# Altium schematic sheet CameraBoard.SchDoc
size A0
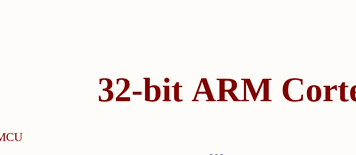
[diagram p0: CameraBoard.SchDoc, top left]
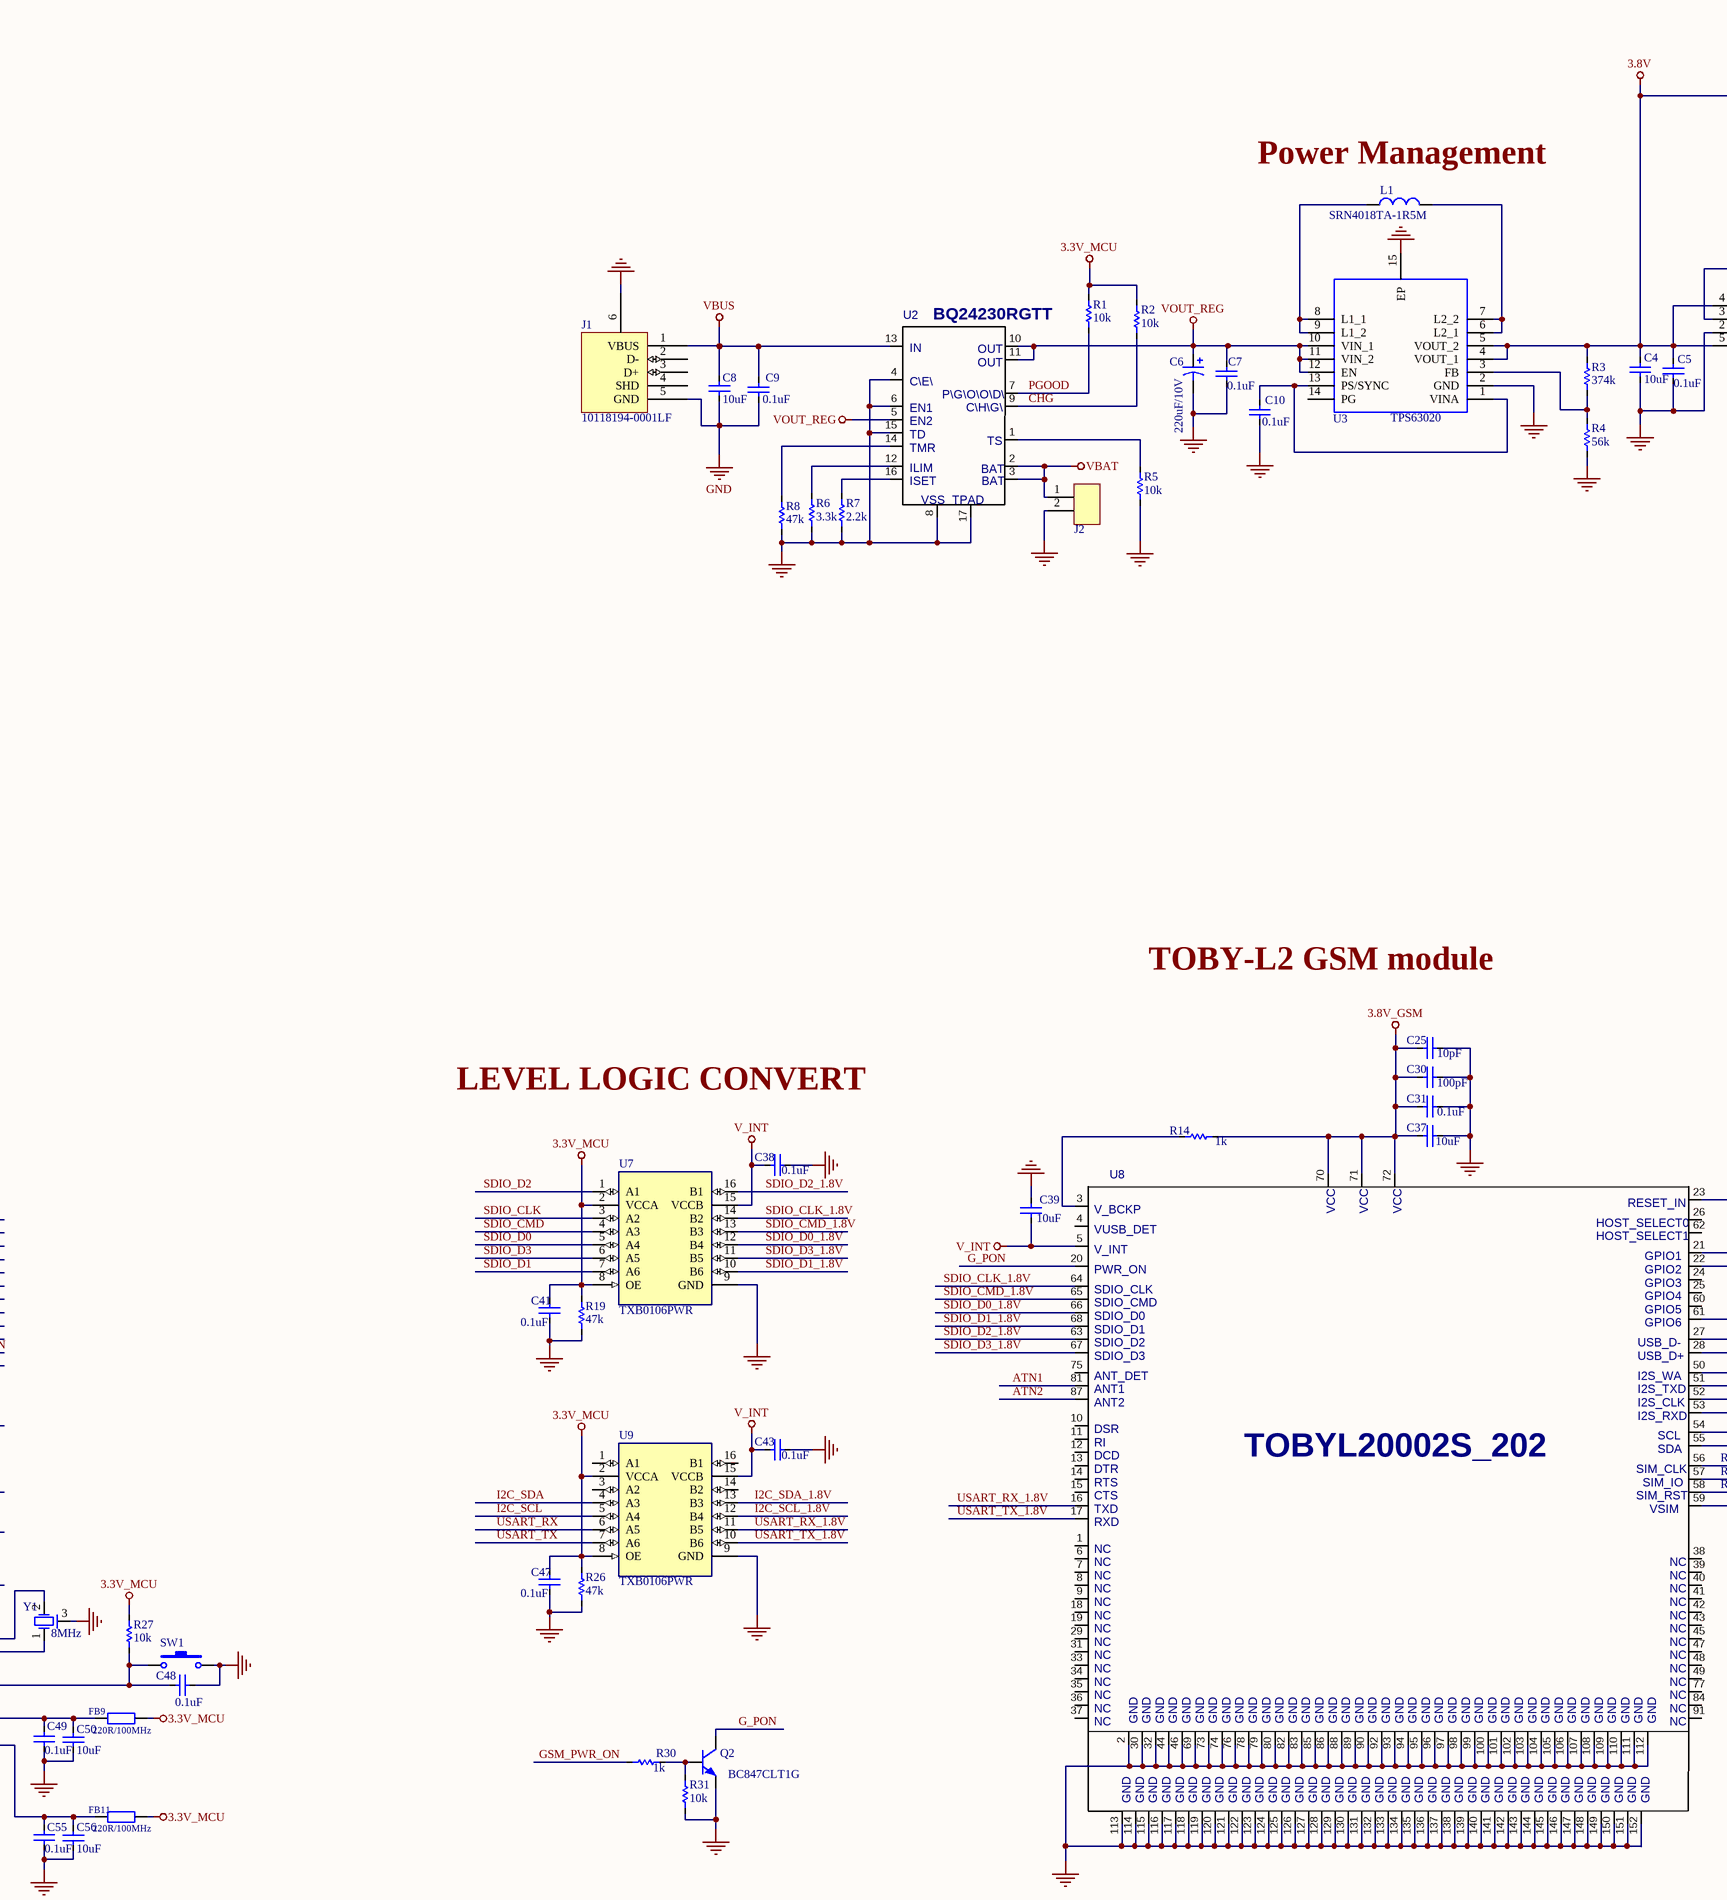
[diagram p1: CameraBoard.SchDoc, top middle]
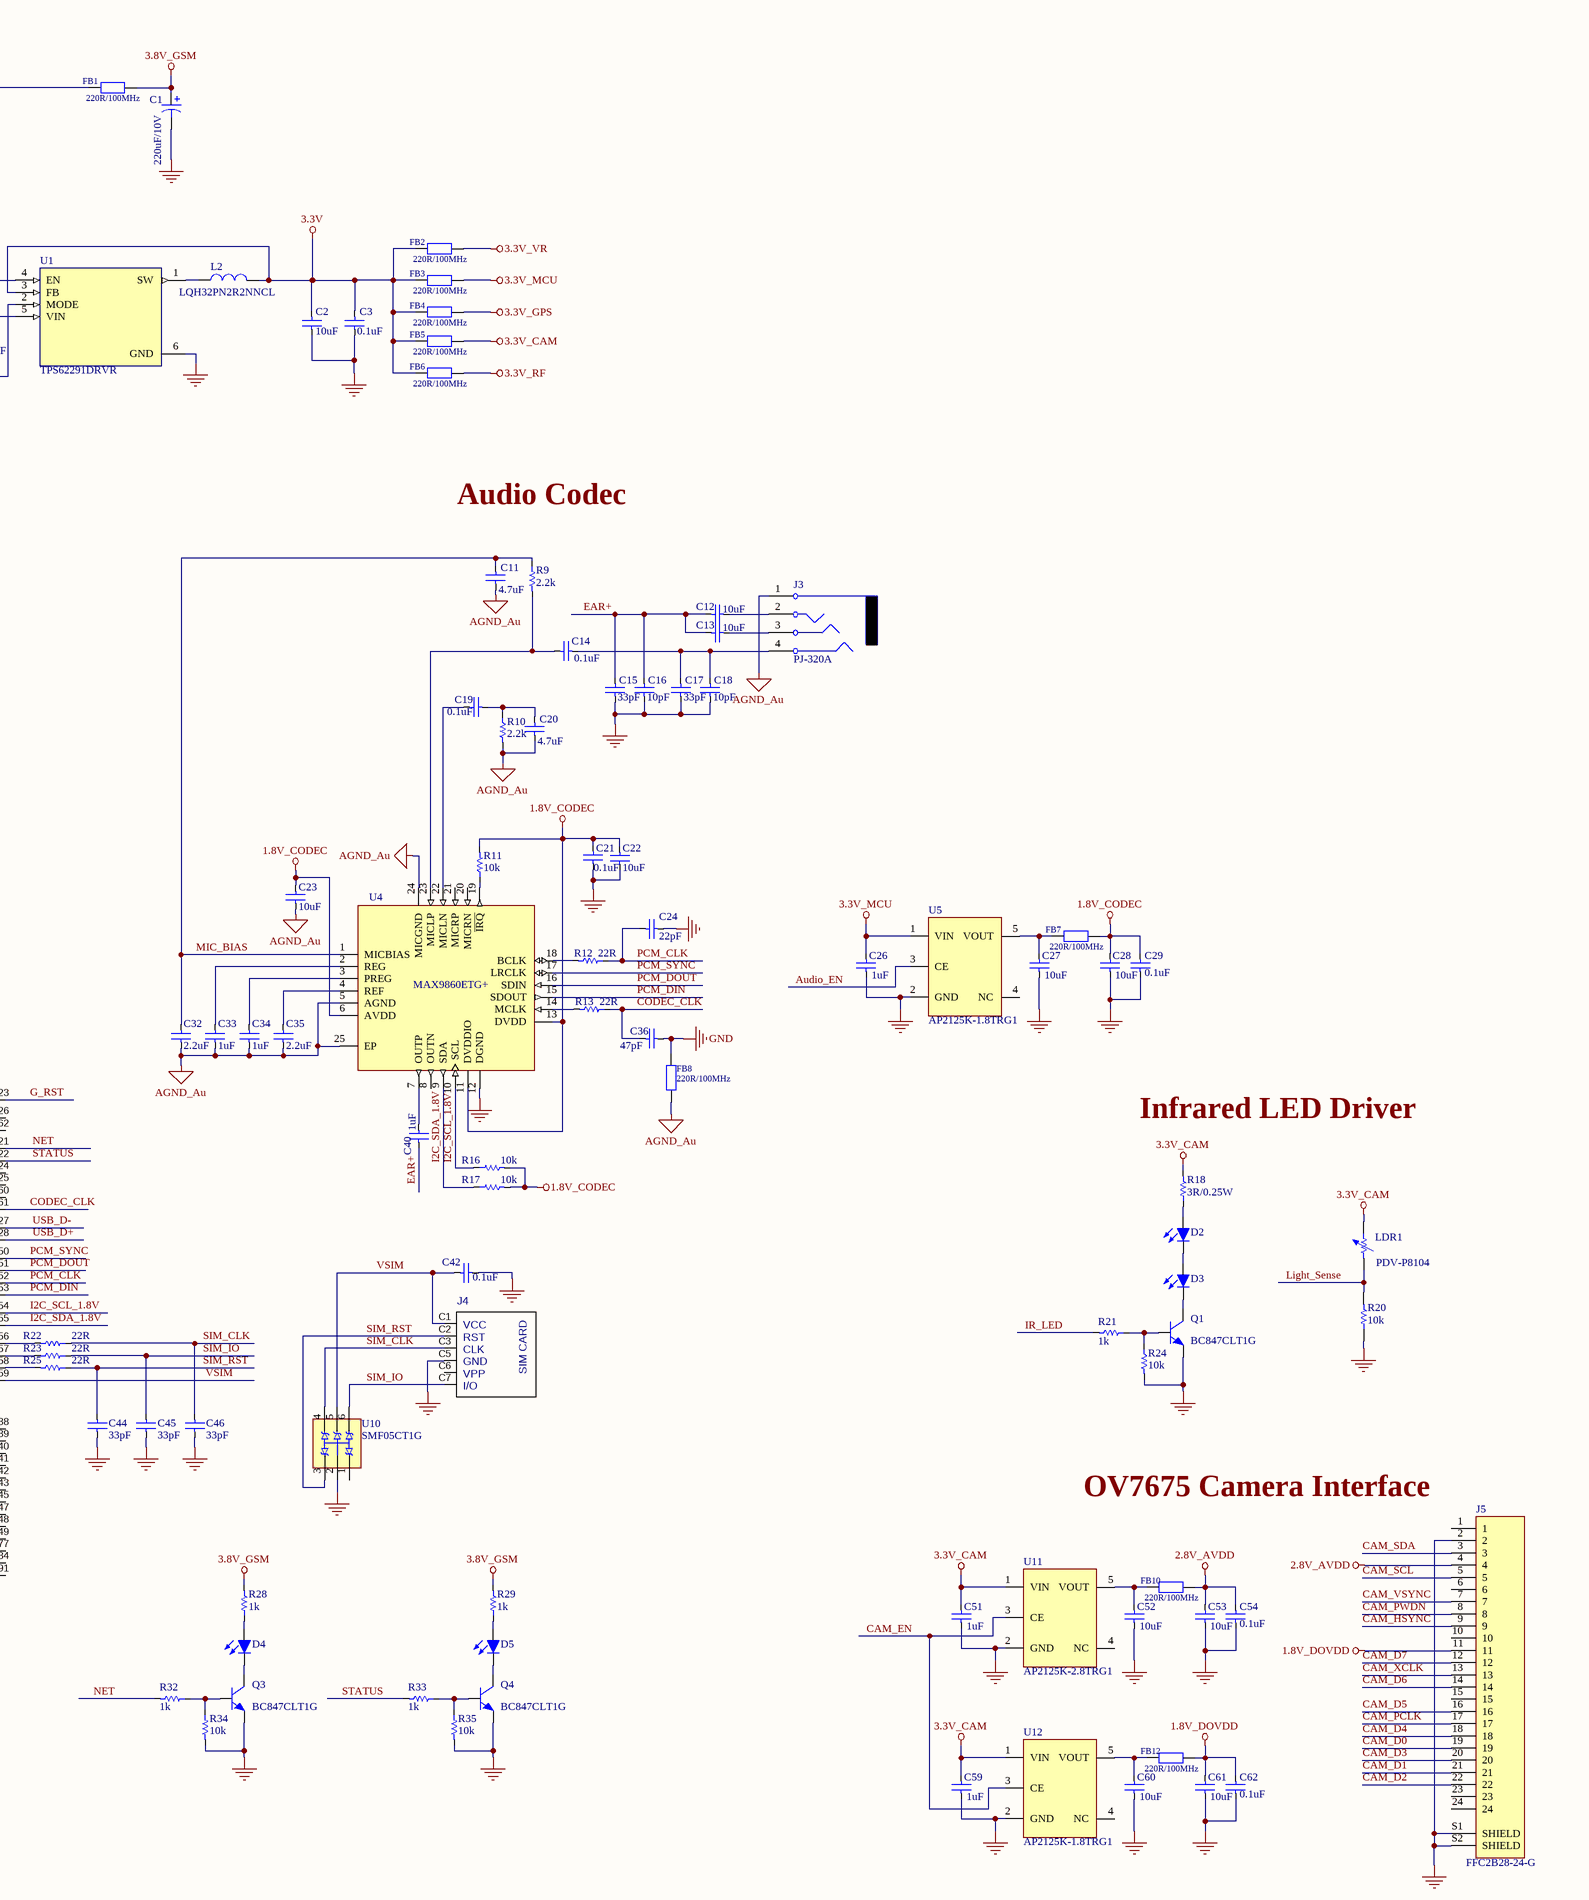
[diagram p2: CameraBoard.SchDoc, top right]
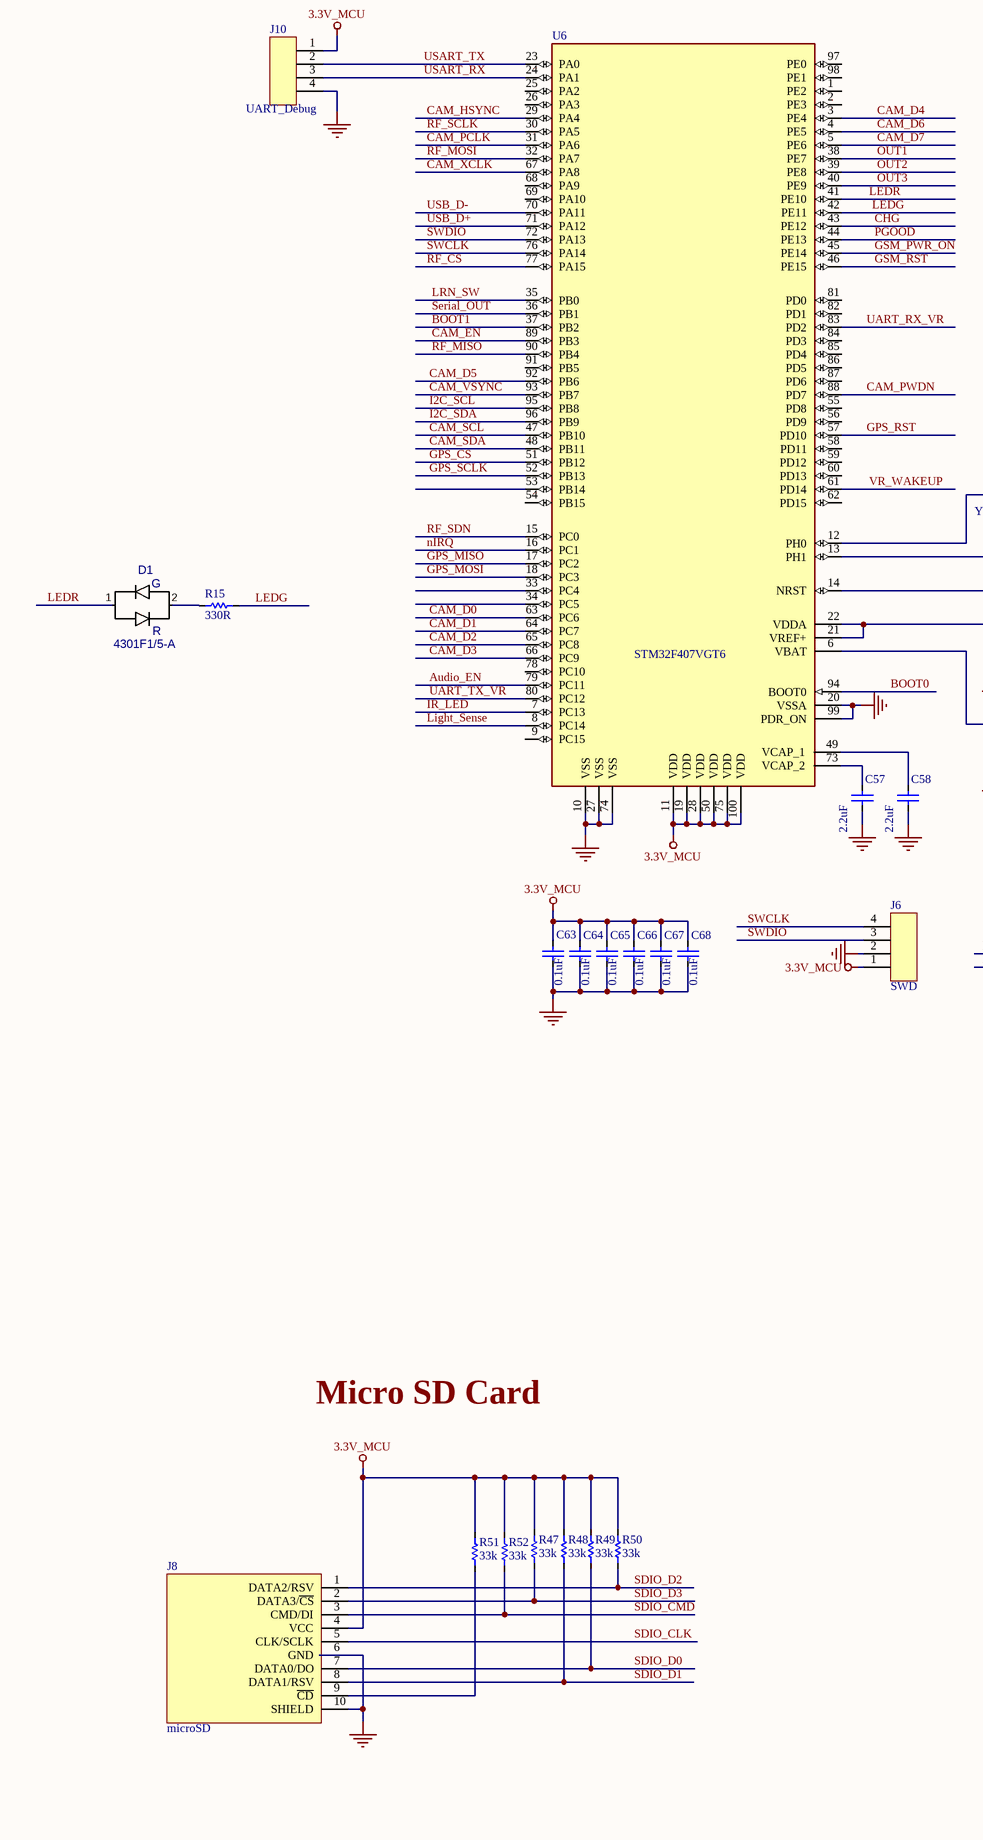
[diagram p3: CameraBoard.SchDoc, bottom left]
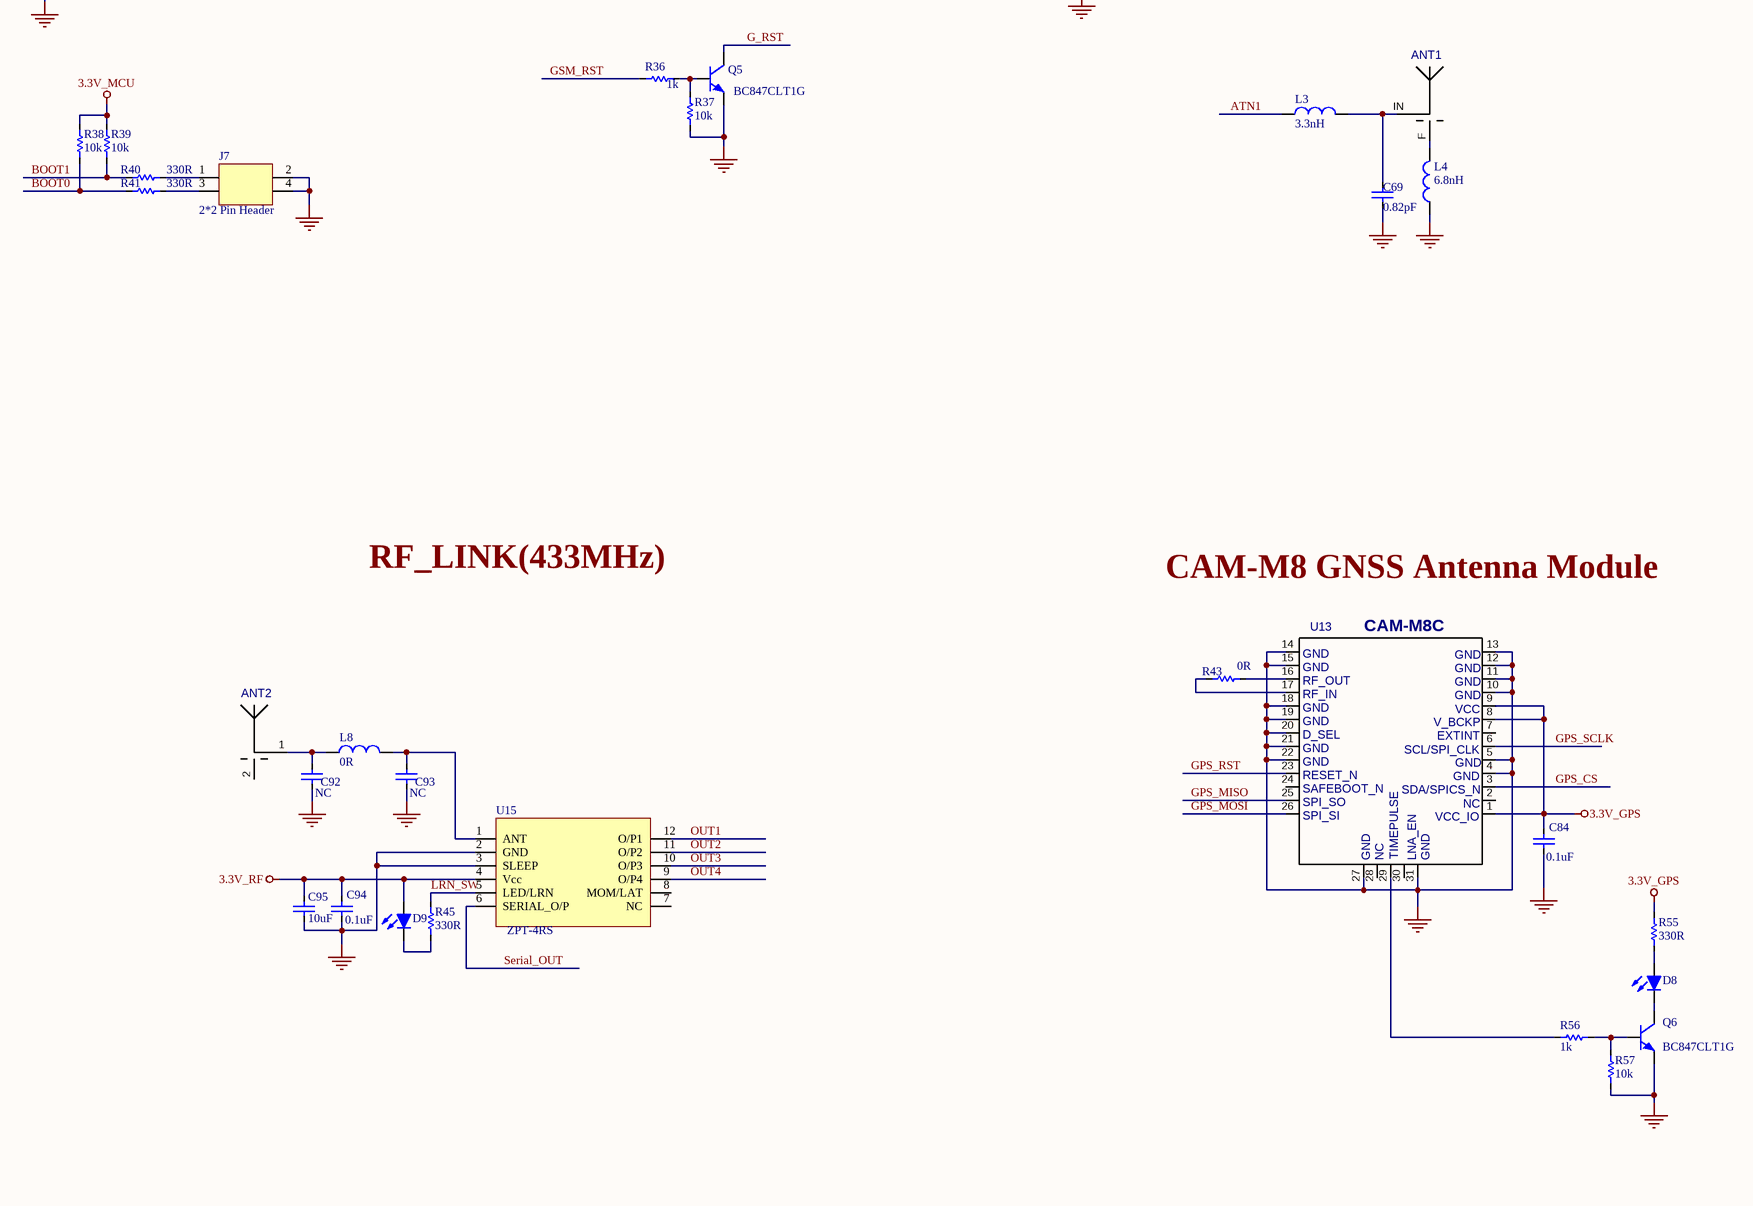
[diagram p4: CameraBoard.SchDoc, bottom middle]
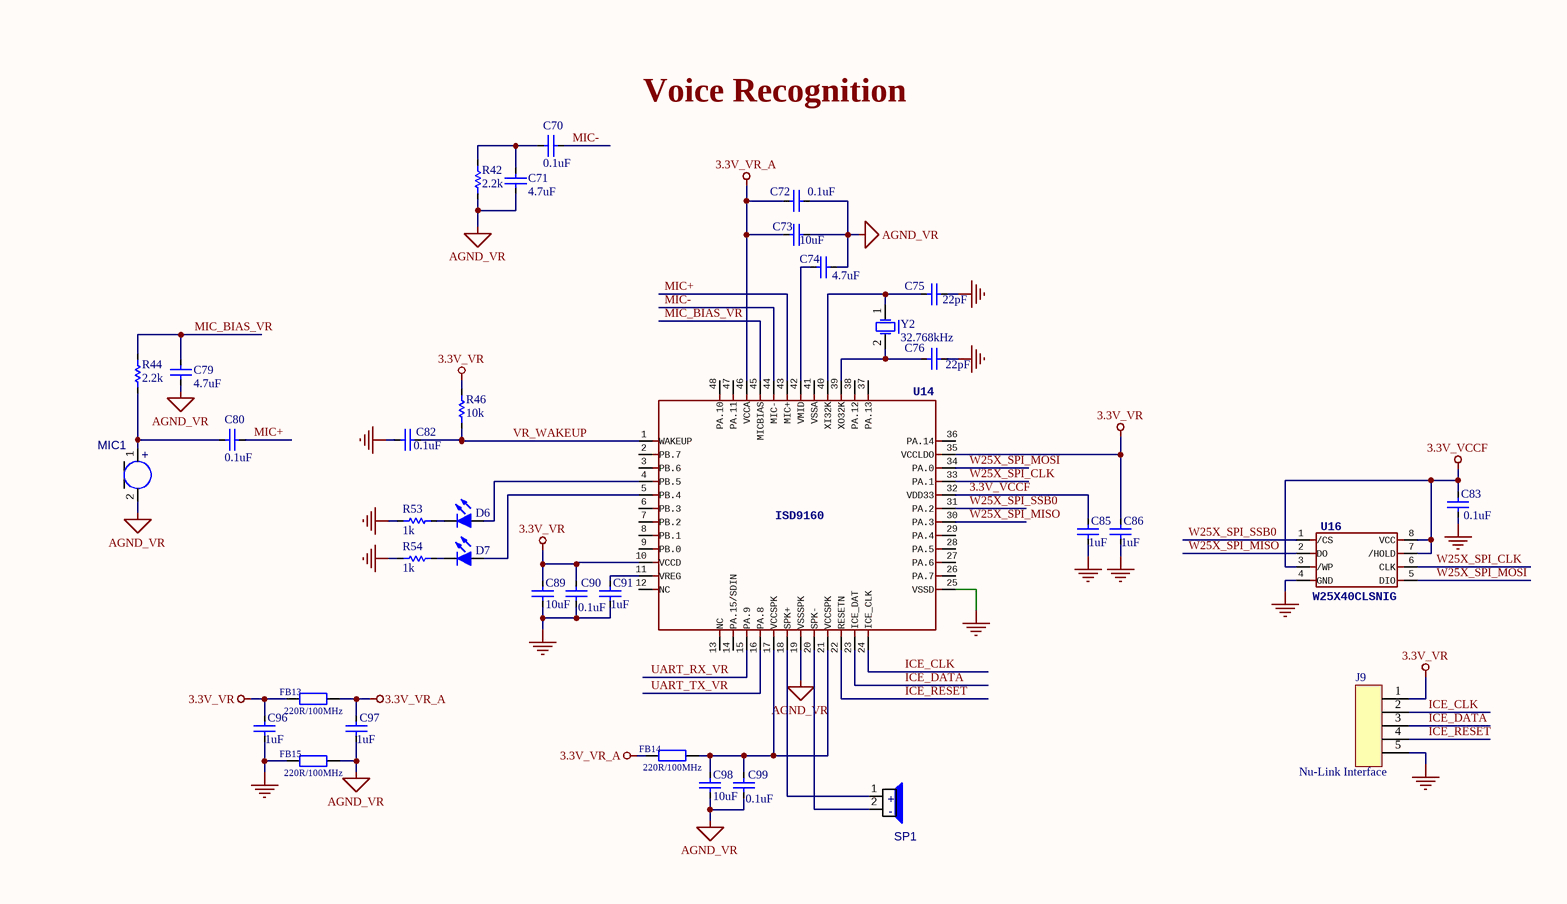
[diagram p5: CameraBoard.SchDoc, bottom right]

## Parts
ANT1  Ant W3796_6  [Ant W3796_Ant W3796(Primary)]  (value not drawn)
ANT2  ACAG1204-868-T  [Antenna_SMD_ANT1204F002R0433A]  (value not drawn)
C1  220uF/10V  [Tantalum C(E)]
C2  10uF  [SMD_C(0603)]
C3  0.1uF  [SMD_C(0402)]
C4  10uF  [SMD_C(0603)]
C5  0.1uF  [SMD_C(0402)]
C6  220uF/10V  [Tantalum C(E)]
C7  0.1uF  [SMD_C(0402)]
C8  10uF  [SMD_C(0603)]
C9  0.1uF  [SMD_C(0402)]
C10  0.1uF  [SMD_C(0402)]
C11  4.7uF  [SMD_C(0603)]
C12  10uF  [SMD_C(0603)]
C13  10uF  [SMD_C(0603)]
C14  0.1uF  [SMD_C(0402)]
C15  33pF  [SMD_C(0402)]
C16  10pF  [SMD_C(0402)]
C17  33pF  [SMD_C(0402)]
C18  10pF  [SMD_C(0402)]
C19  0.1uF  [SMD_C(0402)]
C20  4.7uF  [SMD_C(0603)]
C21  0.1uF  [SMD_C(0402)]
C22  10uF  [SMD_C(0603)]
C23  10uF  [SMD_C(0603)]
C24  22pF  [SMD_C(0402)]
C25  10pF  [SMD_C(0402)]
C26  1uF  [SMD_C(0603)]
C27  10uF  [SMD_C(0603)]
C28  10uF  [SMD_C(0603)]
C29  0.1uF  [SMD_C(0402)]
C30  100pF  [SMD_C(0402)]
C31  0.1uF  [SMD_C(0402)]
C32  2.2uF  [SMD_C(0603)]
C33  1uF  [SMD_C(0603)]
C34  1uF  [SMD_C(0603)]
C35  2.2uF  [SMD_C(0603)]
C36  47pF  [SMD_C(0402)]
C37  10uF  [SMD_C(0603)]
C38  0.1uF  [SMD_C(0402)]
C39  10uF  [SMD_C(0603)]
C40  1uF  [SMD_C(0603)]
C41  0.1uF  [SMD_C(0402)]
C42  0.1uF  [SMD_C(0402)]
C43  0.1uF  [SMD_C(0402)]
C44  33pF  [SMD_C(0402)]
C45  33pF  [SMD_C(0402)]
C46  33pF  [SMD_C(0402)]
C47  0.1uF  [SMD_C(0402)]
C48  0.1uF  [SMD_C(0402)]
C49  0.1uF  [SMD_C(0402)]
C50  10uF  [SMD_C(0603)]
C51  1uF  [SMD_C(0603)]
C52  10uF  [SMD_C(0603)]
C53  10uF  [SMD_C(0603)]
C54  0.1uF  [SMD_C(0402)]
C55  0.1uF  [SMD_C(0402)]
C56  10uF  [SMD_C(0603)]
C57  2.2uF  [SMD_C(0603)]
C58  2.2uF  [SMD_C(0603)]
C59  1uF  [SMD_C(0603)]
C60  10uF  [SMD_C(0603)]
C61  10uF  [SMD_C(0603)]
C62  0.1uF  [SMD_C(0402)]
C63  0.1uF  [SMD_C(0402)]
C64  0.1uF  [SMD_C(0402)]
C65  0.1uF  [SMD_C(0402)]
C66  0.1uF  [SMD_C(0402)]
C67  0.1uF  [SMD_C(0402)]
C68  0.1uF  [SMD_C(0402)]
C69  0.82pF  [SMD_C(0402)]
C70  0.1uF  [SMD_C(0402)]
C71  4.7uF  [SMD_C(0603)]
C72  0.1uF  [SMD_C(0402)]
C73  10uF  [SMD_C(0603)]
C74  4.7uF  [SMD_C(0603)]
C75  22pF  [SMD_C(0402)]
C76  22pF  [SMD_C(0402)]
C79  4.7uF  [SMD_C(0603)]
C80  0.1uF  [SMD_C(0402)]
C82  0.1uF  [SMD_C(0402)]
C83  0.1uF  [SMD_C(0402)]
C84  0.1uF  [SMD_C(0402)]
C85  1uF  [SMD_C(0603)]
C86  1uF  [SMD_C(0603)]
C89  10uF  [SMD_C(0603)]
C90  0.1uF  [SMD_C(0402)]
C91  1uF  [SMD_C(0603)]
C92  NC  [SMD_C(0402)]
C93  NC  [SMD_C(0402)]
C94  0.1uF  [SMD_C(0402)]
C95  10uF  [SMD_C(0603)]
C96  1uF  [SMD_C(0603)]
C97  1uF  [SMD_C(0603)]
C98  10uF  [SMD_C(0603)]
C99  0.1uF  [SMD_C(0402)]
D1  4301F1/5-A  [LED-DIP 3mm]
D2  HSDL-4220  [LED-DIP 5mm]  (value not drawn)
D3  HSDL-4220  [LED-DIP 5mm]  (value not drawn)
D4  Yellow  [SMD_LED(0603)]  (value not drawn)
D5  Green  [SMD_LED(0603)]  (value not drawn)
D6  SML-D12U1WT86  [SMD_LED(0603)]  (value not drawn)
D7  BLUE  [SMD_LED(0603)]  (value not drawn)
D8  SML-D12U1WT86  [SMD_LED(0603)]  (value not drawn)
D9  SML-D12U1WT86  [SMD_LED(0603)]  (value not drawn)
FB1  220R/100MHz  [SMD_R(0603)]
FB2  220R/100MHz  [SMD_R(0603)]
FB3  220R/100MHz  [SMD_R(0603)]
FB4  220R/100MHz  [SMD_R(0603)]
FB5  220R/100MHz  [SMD_R(0603)]
FB6  220R/100MHz  [SMD_R(0603)]
FB7  220R/100MHz  [SMD_R(0603)]
FB8  220R/100MHz  [SMD_R(0603)]
FB9  220R/100MHz  [SMD_R(0603)]
FB10  220R/100MHz  [SMD_R(0603)]
FB11  220R/100MHz  [SMD_R(0603)]
FB12  220R/100MHz  [SMD_R(0603)]
FB13  220R/100MHz  [SMD_R(0603)]
FB14  220R/100MHz  [SMD_R(0603)]
FB15  220R/100MHz  [SMD_R(0603)]
J1  10118194-0001LF  [10118194-0001LF]
J2  2 Pin Connector  [JST_S2B-PH-SM4-TB(LF)(SN)]  (value not drawn)
J3  PJ-320A  [AUDIO-TH_PJ-320A]
J4  78646-3001  [78646-3001]  (value not drawn)
J5  FFC2B28-24-G  [FCI_10051922-3010ELF]
J6  SWD  [Header-2.54m-4pin]
J7  2*2 Pin Header  [Header-2.54m-2*2pin]
J8  microSD  [*MOLEX_47352-1001_47352-1001(Primary)]
J9  Nu-Link Interface  [Header-2.54m-5pin]
J10  UART_Debug  [Header-2.54m-4pin]
L1  SRN4018TA-1R5M  [IND_SRN4018TA-1R5M]
L2  LQH32PN2R2NNCL  [IND_LQH32PN2R2NNCL]
L3  3.3nH  [SMD_R(0603)]
L4  6.8nH  [SMD_R(0603)]
L8  0R  [SMD_R(0402)]
LDR1  PDV-P8104  [PHODET_PDV-P8103]
MIC1  CMEJ-0627-42-P  [MIC_CMEJ-0627-42-P]  (value not drawn)
Q1  BC847CLT1G  [SOT23-3]
Q2  BC847CLT1G  [SOT23-3]
Q3  BC847CLT1G  [SOT23-3]
Q4  BC847CLT1G  [SOT23-3]
Q5  BC847CLT1G  [SOT23-3]
Q6  BC847CLT1G  [SOT23-3]
R1  10k  [SMD_R(0402)]
R2  10k  [SMD_R(0402)]
R3  374k  [SMD_R(0402)]
R4  56k  [SMD_R(0402)]
R5  10k  [SMD_R(0402)]
R6  3.3k  [SMD_R(0402)]
R7  2.2k  [SMD_R(0402)]
R8  47k  [SMD_R(0402)]
R9  2.2k  [SMD_R(0402)]
R10  2.2k  [SMD_R(0402)]
R11  10k  [SMD_R(0402)]
R12  22R  [SMD_R(0402)]
R13  22R  [SMD_R(0402)]
R14  1k  [SMD_R(0402)]
R15  330R  [SMD_R(0402)]
R16  10k  [SMD_R(0402)]
R17  10k  [SMD_R(0402)]
R18  3R/0.25W  [SMD_R(0603)]
R19  47k  [SMD_R(0402)]
R20  10k  [SMD_R(0402)]
R21  1k  [SMD_R(0402)]
R22  22R  [SMD_R(0402)]
R23  22R  [SMD_R(0402)]
R24  10k  [SMD_R(0402)]
R25  22R  [SMD_R(0402)]
R26  47k  [SMD_R(0402)]
R27  10k  [SMD_R(0402)]
R28  1k  [SMD_R(0402)]
R29  1k  [SMD_R(0402)]
R30  1k  [SMD_R(0402)]
R31  10k  [SMD_R(0402)]
R32  1k  [SMD_R(0402)]
R33  1k  [SMD_R(0402)]
R34  10k  [SMD_R(0402)]
R35  10k  [SMD_R(0402)]
R36  1k  [SMD_R(0402)]
R37  10k  [SMD_R(0402)]
R38  10k  [SMD_R(0402)]
R39  10k  [SMD_R(0402)]
R40  330R  [SMD_R(0402)]
R41  330R  [SMD_R(0402)]
R42  2.2k  [SMD_R(0402)]
R43  0R  [SMD_R(0402)]
R44  2.2k  [SMD_R(0402)]
R45  330R  [SMD_R(0402)]
R46  10k  [SMD_R(0402)]
R47  33k  [SMD_R(0402)]
R48  33k  [SMD_R(0402)]
R49  33k  [SMD_R(0402)]
R50  33k  [SMD_R(0402)]
R51  33k  [SMD_R(0402)]
R52  33k  [SMD_R(0402)]
R53  1k  [SMD_R(0402)]
R54  1k  [SMD_R(0402)]
R55  330R  [SMD_R(0402)]
R56  1k  [SMD_R(0402)]
R57  10k  [SMD_R(0402)]
SP1  SPEAKER 10mm_193  [Header-2.54m-2pin]  (value not drawn)
SW1  1825966-1  [SW_1825966-1]  (value not drawn)
U1  TPS62291DRVR  [SON65P200X200X80-7N]
U2  BQ24230RGTT  [VQFN-17N]
U3  TPS63020  [TPS63020]
U4  MAX9860ETG+  [QFN50P400X400X75-25N]
U5  AP2125K-1.8TRG1  [SOT23-5]
U6  STM32F407VGT6  [LQFP-100N]
U7  TXB0106PWR  [TSSOP-16N]
U8  TOBYL20002S_202  [TOBYL20002S_TOBYL20002S(Primary)]
U9  TXB0106PWR  [TSSOP-16N]
U10  SMF05CT1G  [SOT-363]
U11  AP2125K-2.8TRG1  [SOT23-5]
U12  AP2125K-1.8TRG1  [SOT23-5]
U13  CAM-M8C  [CAM-M8C_LCC-31N]
U14  ISD9160  [LQFP-48N]
U15  ZPT-4RS  [ZPT-4RS]
U16  W25X40CLSNIG  [SOIC-8N]
Y1  8MHz  [Resonator_mini]
Y2  32.768kHz  [TC26H_3_REPAIR_SMD]

## Nets
1.8V_CODEC: C21.2 C22.2 C23.2 C28.2 C29.1 FB7.2 R11.2 R16.2 R17.2 U4.6(AVDD) U4.11(DVDDIO) U4.13(DVDD)
1.8V_DOVDD: C61.2 C62.1 FB12.2 J5.11
2.8V_AVDD: C53.2 C54.1 FB10.2 J5.4
3.3V: C2.2 C3.2 FB2.1 FB3.1 FB4.1 FB5.1 FB6.1 L2.2 U1.3(FB)
3.3V_CAM: C51.2 C59.2 FB5.2 LDR1.2 R18.2 U11.1(VIN) U12.1(VIN)
3.3V_GPS: C84.2 FB4.2 R55.2 U13.1 U13.8 U13.9
3.3V_MCU: C26.2 C41.1 C47.1 C63.2 C64.2 C65.2 C66.2 C67.2 C68.2 FB3.2 FB9.2 FB11.2 J6.1 J8.4(VCC) J10.1 R1.1 R2.1 R19.2 R26.2 R27.1 R38.1 R39.1 R47.2 R48.2 R49.2 R50.2 R51.2 R52.2 U5.1(VIN) U6.11(VDD) U6.19(VDD) U6.28(VDD) U6.50(VDD) U6.75(VDD) U6.100(VDD) U7.2(VCCA) U7.8(OE) U9.2(VCCA) U9.8(OE)
3.3V_RF: C94.2 C95.2 D9.1(A) FB6.2 U15.4(Vcc)
3.3V_VCCF: C83.2 C85.2 U14.32(VDD33) U16.3(/WP) U16.7(/HOLD) U16.8(VCC)
3.3V_VR: C86.2 C89.2 C90.1 C96.2 FB2.2 FB13.1 J9.1 R46.1 U14.10(VCCD) U14.35(VCCLDO)
3.3V_VR_A: C72.1 C73.2 C97.2 FB13.2 FB14.1 U14.46(VCCA)
3.8V: C4.2 C5.1 FB1.1 R3.1 U1.4(EN) U1.5(VIN) U3.4(VOUT_1) U3.5(VOUT_2)
3.8V_GSM: C1.1 C25.1 C30.1 C31.1 C37.1 FB1.2 R14.1 R28.2 R29.2 U8.70 U8.71 U8.72
AGND_Au: C11.1 C20.1 C23.1 C32.1 C33.1 C34.1 C35.1 FB8.1 J3.1 R10.2 U4.5(AGND) U4.24(MICGND) U4.25(EP)
AGND_VR: C71.1 C72.2 C73.1 C74.1 C79.1 C97.1 C98.1 C99.2 FB15.2 MIC1.2 R42.2 U14.19(VSSSPK)
GND: C1.2 C2.1 C3.1 C4.1 C5.2 C6.2 C7.2 C8.1 C9.1 C10.1 C15.2 C16.2 C17.2 C18.2 C21.1 C22.1 C24.1 C25.2 C26.1 C27.1 C28.1 C29.2 C30.2 C31.2 C36.1 C37.2 C38.1 C39.2 C41.2 C42.2 C43.1 C44.1 C45.1 C46.1 C47.2 C48.1 C49.1 C50.1 C51.1 C52.1 C53.1 C54.2 C55.1 C56.1 C57.1 C58.1 C59.1 C60.1 C61.1 C62.2 C63.1 C64.1 C65.1 C66.1 C67.1 C68.1 C69.2 C75.2 C76.2 C82.1 C83.1 C84.1 C85.1 C86.1 C89.1 C90.2 C91.1 C92.2 C93.2 C94.1 C95.1 C96.1 FB8.2 FB15.1 J1.5(GND) J1.6 J2.2 J4.C5 J5.2 J5.S1(SHIELD) J5.S2(SHIELD) J6.2 J7.2 J7.4 J8.6(GND) J8.10(SHIELD) J9.5 J10.4 L4.1 Q1.2(E) Q2.2(E) Q3.2(E) Q4.2(E) Q5.2(E) Q6.2(E) R4.2 R5.2 R6.2 R7.2 R8.2 R19.1 R20.1 R24.2 R26.1 R31.2 R34.2 R35.2 R37.2 R53.1 R54.1 R57.2 SW1.2 U1.2(MODE) U1.6(GND) U2.4 U2.6 U2.8 U2.15 U2.17 U3.2(GND) U3.15(EP) U4.12(DGND) U5.2(GND) U6.10(VSS) U6.20(VSSA) U6.27(VSS) U6.74(VSS) U6.99(PDR_ON) U7.9(GND) U8.2 U8.30 U8.32 U8.44 U8.46 U8.69 U8.73 U8.74 U8.76 U8.78 U8.79 U8.80 U8.82 U8.83 U8.85 U8.86 U8.88 U8.89 U8.90 U8.92 U8.93 U8.94 U8.95 U8.96 U8.97 U8.98 U8.99 U8.100 U8.101 U8.102 U8.103 U8.104 U8.105 U8.106 U8.107 U8.108 U8.109 U8.110 U8.111 U8.112 U8.113 U8.114 U8.115 U8.116 U8.117 U8.118 U8.119 U8.120 U8.121 U8.122 U8.123 U8.124 U8.125 U8.126 U8.127 U8.128 U8.129 U8.130 U8.131 U8.132 U8.133 U8.134 U8.135 U8.136 U8.137 U8.138 U8.139 U8.140 U8.141 U8.142 U8.143 U8.144 U8.145 U8.146 U8.147 U8.148 U8.149 U8.150 U8.151 U8.152 U9.9(GND) U10.2(A) U11.2(GND) U12.2(GND) U13.4 U13.5 U13.10 U13.11 U13.12 U13.13 U13.14 U13.15 U13.18 U13.19 U13.20 U13.21 U13.22 U13.27 U13.31 U14.25(VSSD) U15.2(GND) U15.3(SLEEP) U16.4(GND) Y1.3(OSC2)
V_INT: C38.2 C39.1 C43.2 U7.15(VCCB) U8.5 U9.15(VCCB)
VBAT: J2.1 U2.2 U2.3
VBUS: C8.2 C9.2 J1.1(VBUS) U2.13
VOUT_REG: C6.1 C7.1 U2.5 U2.10 U2.11 U3.10(VIN_1) U3.11(VIN_2) U3.12(EN)
ATN1: L3.1 U8.81
ATN2: U8.87
Audio_EN: U5.3(CE) U6.79(PC11)
BOOT0: R38.2 R41.1 U6.94(BOOT0)
BOOT1: R39.2 R40.1 U6.37(PB2)
CAM_D0: J5.19 U6.63(PC6)
CAM_D1: J5.21 U6.64(PC7)
CAM_D2: J5.22 U6.65(PC8)
CAM_D3: J5.20 U6.66(PC9)
CAM_D4: J5.18 U6.3(PE4)
CAM_D5: J5.16 U6.92(PB6)
CAM_D6: J5.14 U6.4(PE5)
CAM_D7: J5.12 U6.5(PE6)
CAM_EN: U6.89(PB3) U11.3(CE) U12.3(CE)
CAM_HSYNC: J5.9 U6.29(PA4)
CAM_PCLK: J5.17 U6.31(PA6)
CAM_PWDN: J5.8 U6.88(PD7)
CAM_SCL: J5.5 U6.47(PB10)
CAM_SDA: J5.3 U6.48(PB11)
CAM_VSYNC: J5.7 U6.93(PB7)
CAM_XCLK: J5.13 U6.67(PA8)
CHG: R2.2 U2.9 U6.43(PE12)
CODEC_CLK: C36.2 R13.1 U8.61
EAR+: C12.2 C13.2 C15.1 C16.1 C40.1
G_PON: Q2.3(C) U8.20
G_RST: Q5.3(C) U8.23
GPS_CS: U6.51(PB12) U13.3
GPS_MISO: U6.17(PC2) U13.25
GPS_MOSI: U6.18(PC3) U13.26
GPS_RST: U6.57(PD10) U13.23
GPS_SCLK: U6.52(PB13) U13.6
GSM_PWR_ON: R30.2 U6.45(PE14)
GSM_RST: R36.2 U6.46(PE15)
I2C_SCL: U6.95(PB8) U9.5(A4)
I2C_SCL_1.8V: R16.1 U4.10(SCL) U8.54 U9.12(B4)
I2C_SDA: U6.96(PB9) U9.4(A3)
I2C_SDA_1.8V: R17.1 U4.9(SDA) U8.55 U9.13(B3)
ICE_CLK: J9.2 U14.24(ICE_CLK)
ICE_DATA: J9.3 U14.23(ICE_DAT)
ICE_RESET: J9.4 U14.22(RESETN)
IR_LED: R21.2 U6.7(PC13)
LEDG: R15.1 U6.42(PE11)
LEDR: D1.1(R) U6.41(PE10)
Light_Sense: LDR1.1 R20.2 U6.8(PC14)
LRN_SW: R45.2 U6.35(PB0) U15.5(LED/LRN)
MIC+: C80.2 U14.43(MIC+)
MIC-: C70.2 U14.44(MIC-)
MIC_BIAS: C11.2 C32.2 R9.1 U4.1(MICBIAS)
MIC_BIAS_VR: C79.2 R44.1 U14.45(MICBIAS)
NET: R32.2 U8.21
nIRQ: U6.16(PC1)
OUT1: U6.38(PE7) U15.12(O/P1)
OUT2: U6.39(PE8) U15.11(O/P2)
OUT3: U6.40(PE9) U15.10(O/P3)
OUT4: U15.9(O/P4)
PCM_CLK: C24.2 R12.1 U8.52
PCM_DIN: U4.15(SDOUT) U8.53
PCM_DOUT: U4.16(SDIN) U8.51
PCM_SYNC: U4.17(LRCLK) U8.50
PGOOD: R1.2 U2.7 U6.44(PE13)
RF_CS: U6.77(PA15)
RF_MISO: U6.90(PB4)
RF_MOSI: U6.32(PA7)
RF_SCLK: U6.30(PA5)
RF_SDN: U6.15(PC0)
SDIO_CLK: J8.5(CLK/SCLK) U7.3(A2)
SDIO_CLK_1.8V: U7.14(B2) U8.64
SDIO_CMD: J8.3(CMD/DI) R52.1 U7.4(A3)
SDIO_CMD_1.8V: U7.13(B3) U8.65
SDIO_D0: J8.7(DATA0/DO) R49.1 U7.5(A4)
SDIO_D0_1.8V: U7.12(B4) U8.66
SDIO_D1: J8.8(DATA1/RSV) R48.1 U7.7(A6)
SDIO_D1_1.8V: U7.10(B6) U8.68
SDIO_D2: J8.1(DATA2/RSV) R50.1 U7.1(A1)
SDIO_D2_1.8V: U7.16(B1) U8.63
SDIO_D3: J8.2(DATA3/~{CS}) R47.1 U7.6(A5)
SDIO_D3_1.8V: U7.11(B5) U8.67
Serial_OUT: U6.36(PB1) U15.6(SERIAL_O/P)
SIM_CLK: C46.2 J4.C3 R22.1 U10.4(C3)
SIM_IO: C45.2 J4.C7 R23.1 U10.6(C5)
SIM_RST: C44.2 J4.C2 R25.1 U10.3(C2)
STATUS: R33.2 U8.22
SWCLK: J6.4 U6.76(PA14)
SWDIO: J6.3 U6.72(PA13)
UART_RX_VR: U6.83(PD2) U14.15(PA.9)
UART_TX_VR: U6.80(PC12) U14.16(PA.8)
USART_RX: J10.3 U6.24(PA1) U9.6(A5)
USART_RX_1.8V: U8.16 U9.11(B5)
USART_TX: J10.2 U6.23(PA0) U9.7(A6)
USART_TX_1.8V: U8.17 U9.10(B6)
USB_D+: U6.71(PA12) U8.28
USB_D-: U6.70(PA11) U8.27
VR_WAKEUP: C82.2 R46.2 U6.61(PD14) U14.1(WAKEUP)
VSIM: C42.1 J4.C1 U8.59 U10.5(C4)
W25X_SPI_CLK: U14.33(PA.1) U16.6(CLK)
W25X_SPI_MISO: U14.30(PA.3) U16.2(DO)
W25X_SPI_MOSI: U14.34(PA.0) U16.5(DIO)
W25X_SPI_SSB0: U14.31(PA.2) U16.1(/CS)
NetANT1_F: ANT1.F L4.2
NetANT1_IN: ANT1.IN C69.1 L3.2
NetANT2_1: ANT2.1(IN) C92.1 L8.1
NetC10_2: C10.2 U3.1(VINA) U3.13(PS/SYNC)
NetC12_1: C12.1 J3.2
NetC13_1: C13.1 J3.3
NetC14_1: C14.1 C17.1 C18.1 J3.4
NetC14_2: C14.2 R9.2 U4.23(MICLP)
NetC19_1: C19.1 C20.2 R10.1
NetC19_2: C19.2 U4.22(MICLN)
NetC27_2: C27.2 FB7.1 U5.5(VOUT)
NetC33_2: C33.2 U4.2(REG)
NetC34_2: C34.2 U4.3(PREG)
NetC35_2: C35.2 U4.4(REF)
NetC40_2: C40.2 U4.7(OUTP)
NetC48_2: C48.2 R27.2 SW1.1 U6.14(NRST)
NetC49_2: C49.2 C50.2 FB9.1 U6.21(VREF+) U6.22(VDDA)
NetC52_2: C52.2 FB10.1 U11.5(VOUT)
NetC55_2: C55.2 C56.2 FB11.1 U6.6(VBAT)
NetC57_2: C57.2 U6.73(VCAP_2)
NetC58_2: C58.2 U6.49(VCAP_1)
NetC60_2: C60.2 FB12.1 U12.5(VOUT)
NetC70_1: C70.1 C71.2 R42.1
NetC74_2: C74.2 U14.42(VMID)
NetC75_1: C75.1 U14.40(XI32K) Y2.1(OSC1)
NetC76_1: C76.1 U14.39(XO32K) Y2.2(OSC2)
NetC80_1: C80.1 MIC1.1 R44.2
NetC91_2: C91.2 U14.11(VREG)
NetC93_1: C93.1 L8.2 U15.1(ANT)
NetC98_2: C98.2 C99.1 FB14.2 U14.17(VCCSPK) U14.21(VCCSPK)
NetD1_2: D1.2(G) R15.2
NetD2_1: D2.1(A) R18.1
NetD2_2: D2.2(K) D3.1(A)
NetD3_2: D3.2(K) Q1.3(C)
NetD4_1: D4.1(A) R28.1
NetD4_2: D4.2(K) Q3.3(C)
NetD5_1: D5.1(A) R29.1
NetD5_2: D5.2(K) Q4.3(C)
NetD6_1: D6.1(A) U14.4(PB.5)
NetD6_2: D6.2(K) R53.2
NetD7_1: D7.1(A) U14.5(PB.4)
NetD7_2: D7.2(K) R54.2
NetD8_1: D8.1(A) R55.1
NetD8_2: D8.2(K) Q6.3(C)
NetD9_2: D9.2(K) R45.1
NetJ7_1: J7.1 R40.2
NetJ7_3: J7.3 R41.2
NetJ8_9: J8.9(~{CD}) R51.1
NetL1_1: L1.1 U3.8(L1_1) U3.9(L1_2)
NetL1_2: L1.2 U3.6(L2_1) U3.7(L2_2)
NetL2_1: L2.1 U1.1(SW)
NetQ1_1: Q1.1(B) R21.1 R24.1
NetQ2_1: Q2.1(B) R30.1 R31.1
NetQ3_1: Q3.1(B) R32.1 R34.1
NetQ4_1: Q4.1(B) R33.1 R35.1
NetQ5_1: Q5.1(B) R36.1 R37.1
NetQ6_1: Q6.1(B) R56.1 R57.1
NetR3_2: R3.2 R4.1 U3.3(FB)
NetR5_1: R5.1 U2.1
NetR6_1: R6.1 U2.12
NetR7_1: R7.1 U2.16
NetR8_1: R8.1 U2.14
NetR11_1: R11.1 U4.19(~{IRQ})
NetR12_2: R12.2 U4.18(BCLK)
NetR13_2: R13.2 U4.14(MCLK)
NetR14_2: R14.2 U8.3
NetR22_2: R22.2 U8.56
NetR23_2: R23.2 U8.57
NetR25_2: R25.2 U8.58
NetR43_1: R43.1 U13.16
NetR43_2: R43.2 U13.17
NetR56_2: R56.2 U13.29
NetSP1_1: SP1.1(SP+) U14.18(SPK+)
NetSP1_2: SP1.2(SP-) U14.20(SPK-)
NetU6_12: U6.12(PH0) Y1.2(OSC2)
NetU6_13: U6.13(PH1) Y1.1(OSC1)

Not connected (* = marked no-connect by the designer): ANT2 2(F); J1 2(D-) 3(D+) 4(SHD); J4 C6; J5 1 6 10 15 23 24; U3 14(PG); U4 8(OUTN) 20(MICRN) 21(MICRP); U5 4(NC); U6 1(PE2) 2(PE3) 9(PC15) 25(PA2) 26(PA3) 33(PC4) 34(PC5) 53(PB14) 54(PB15) 55(PD8) 56(PD9) 58(PD11) 59(PD12) 60(PD13) 62(PD15) 68(PA9) 69(PA10) 78(PC10) 81(PD0) 82(PD1) 84(PD3) 85(PD4) 86(PD5) 87(PD6) 91(PB5) 97(PE0) 98(PE1); U8 1 4 6 7 8 9 10 11 12 13 14 15 18 19 24 25 26 29 31 33 34 35 36 37 38 39 40 41 42 43 45 47 48 49 60 62 75 77 84 91; U9 1(A1) 3(A2) 14(B2) 16(B1); U10 1(C1); U11 4(NC); U12 4(NC); U13 2 7 24 28 30; U14 2(PB.7) 3(PB.6) 6(PB.3) 7(PB.2) 8(PB.1) 9(PB.0) 12(NC) 13(NC) 14(PA.15/SDIN) 26(PA.7) 27(PA.6) 28(PA.5) 29(PA.4) 36(PA.14) 37(PA.13) 38(PA.12) 41(VSSA) 47(PA.11) 48(PA.10); U15 7(NC) 8(MOM/LAT)

## Notes on the sheet
- (near L1) Power Management
- Audio Codec
- TOBY-L2 GSM module
- 32-bit ARM Cortex-M4 MCU
- LEVEL LOGIC CONVERT
- Infrared LED Driver
- (near J5) OV7675 Camera Interface
- Voice Recognition
- RF_LINK(433MHz)
- CAM-M8 GNSS Antenna Module
- Micro SD Card
- (in symbol BQ24230_200) IN; OUT; C\E\; P\G\O\O\D\; EN1; C\H\G\; EN2; TD; TS; TMR; ILIM; BAT; ISET; VSS; TPAD
- (in symbol CAM-M8C_79) GND; RF_OUT; RF_IN; VCC; V_BCKP; D_SEL; EXTINT; SCL/SPI_CLK; RESET_N; SAFEBOOT_N; SDA/SPICS_N; SPI_SO; NC; SPI_SI; VCC_IO; TIMEPULSE; LNA_EN
- (in symbol CN SimCard_63) VCC; RST; CLK; GND; VPP; SIM CARD; I/O
- (in symbol MICPHONE_80) +
- (in symbol SPEAKER 10mm_193) +; -
- (in symbol TOBYL20002S_202) RESET_IN; V_BCKP; VCC; HOST_SELECT0; VUSB_DET; HOST_SELECT1; V_INT; GPIO1; PWR_ON; GPIO2; GPIO3; SDIO_CLK; GPIO4; SDIO_CMD; GPIO5; SDIO_D0; GPIO6; SDIO_D1; SDIO_D2; USB_D-; SDIO_D3; USB_D+; ANT_DET; I2S_WA; ANT1; I2S_TXD; ANT2; I2S_CLK; I2S_RXD; DSR; SCL; RI; SDA; DCD; DTR; SIM_CLK; RTS; SIM_IO; CTS; SIM_RST; TXD; VSIM; RXD; NC; GND

## Library data of the parts
ANT2 = Ant W3796_6: RF ANT 868MHZ CHIP SOLDER SMD; Value: *
C1 C6 = Cap Pol1: TPSE227K010T0100V; Published: 8-Jun-2000; LatestRevisionDate: 17-Jul-2002; LatestRevisionNote: Re-released for DXP Platform.; PackageReference: RB7.6-15; Publisher: Altium Limited; PackageDescription: Polarized Capacitor (Radial); 2 Leads
C2-C5 C7-C76 C79 C80 C82-C86 C89-C99 = Cap: PHE840MA6100MA04R17; Manufacturer: Yageo; Manufacturer Part Number: CC0603KPX7R9BB104; Supplier 1: Digi-Key; Supplier Part Number 1: 311-3567-1-ND
D1 = ledBicolor3mmRG_77: Value: *
D2-D6 D8 D9 = LED1: Typical RED GaAs LED; Published: Yellow; LatestRevisionDate: 08-Jul-2005; LatestRevisionNote: Mech Layer 1 removed.; PackageReference: LED-1; Publisher: Altium Limited; PackageDescription: LED; 2 Leads
D7 = LED1: Typical BLUE GaAs LED; Published: Yellow; LatestRevisionDate: 08-Jul-2005; LatestRevisionNote: Mech Layer 1 removed.; PackageReference: LED-1; Publisher: Altium Limited; PackageDescription: LED; 2 Leads
FB1-FB15 = Res2: BLM18KG221SN1D Ferrite Bead(0603); Published: 8-Jun-2000; LatestRevisionDate: 17-Jul-2002; LatestRevisionNote: Re-released for DXP Platform.; PackageReference: AXIAL-0.4; Publisher: Altium Limited; PackageDescription: Axial Device, Thru-Hole; 2 Leads; 0.4 in Pin Spacing
J1 = 10118194-0001LF: CONN RCPT USB2.0 MICRO B SMD R/A; Manufacturer: Amphenol FCI; Gender: Receptacle; Current Rating: 1.8A; Connector Type: USB,Receptacle; Number of Contacts: 5; Insulation Resistance: 1GR; Number of Ports: 1; Max Voltage Rating (AC): 100V; Pitch: 0.65mm; Supplier 1: Digi-Key; Supplier Part Number 1: 609-4618-1-ND; Manufacturer Part Number: 10118194-0001LF; Stock 1: 145984; Pricing 1: 1=0.42, 10=0.393, 25=0.3536, 50=0.3144, 100=0.3013, 250=0.27512, 500=0.26202 (USD); Mount: Surface Mount,Horizontal; Contact Material: Copper Alloy; Contact Plating: Gold; Number of Terminals: 5; Housing Material: Polymer; Color: Black; Min Operating Temperature: -55°C; Max Operating Temperature: 85°C; Package Quantity: 9600; Packaging: Tape and Reel; Termination: Solder; Orientation: Right Angle; Features: Shielded; Length: 8.05mm; Depth: 5mm; Radiation Hardening: No; Lead Free: Lead Free; Flammability Rating: UL94 V-0; ComponentLink1URL: http://www.amphenol-icc.com/media/wysiwyg/files/drawing/10118194.pdf?src-supplier=Digi-Key; ComponentLink1Description: http://www.amphenol-icc.com/media/wysiwyg/files/drawing/10118194.pdf?src-supplier=Digi-Key; ComponentLink2URL: https://cdn.amphenol-icc.com/media/wysiwyg/files/drawing/10118194.pdf?src-supplier=Mouser; ComponentLink2Description: https://cdn.amphenol-icc.com/media/wysiwyg/files/drawing/10118194.pdf?src-supplier=Mouser; ComponentLink3URL: https://cdn.amphenol-icc.com/media/wysiwyg/files/drawing/10118194.pdf?src-supplier=Avnet; ComponentLink3Description: https://cdn.amphenol-icc.com/media/wysiwyg/files/drawing/10118194.pdf?src-supplier=Avnet; ComponentLink4URL: https://cdn.amphenol-icc.com/media/wysiwyg/files/drawing/10118194.pdf?src-supplier=Verical; ComponentLink4Description: https://cdn.amphenol-icc.com/media/wysiwyg/files/drawing/10118194.pdf?src-supplier=Verical
J2 = 2PinConnector: JST_S2B-PH-SM4-TB(LF)(SN)
J3 = PJ-320A: Connector, 3.5mm Stereo Audio Socket, Black
J4 = CN SimCard_63: Value: *
J5 = FFC2B28-24-G: UC7675-A66 connector; MF: Global Connector Technology; SnapEDA_Link: https://www.snapeda.com/parts/FFC2B28-24-G/Global%20Connector%20Technology/view-part/4223067/?ref=snap; MP: FFC2B28-24-G; Price: None; Value: *; Availability: Unavailable; Package: Package Analog Devices
J6 J10 = 4PinConnector
J8 = SD CARD SOCKET_1: SD CARD SOCKET; Published: 8-Jun-2000; LatestRevisionDate: 17-Jul-2002; LatestRevisionNote: Re-released for DXP Platform.; DatasheetVersion: REV. B; PackageVersion: 1990; PackageReference: H-08A; Publisher: Altium Limited; PackageDescription: Can; 8 Leads; Pin Circle Dia. 5.08 mm; Lead Dia. 0.53 mm (max); ComponentLink1Description: Manufacturer Link; ComponentLink1URL: http://www.analog.com/
J9 = 5PinConnector
L1 = Inductor: Code_IEC: 1005; Published: 8-Jun-2000; LatestRevisionDate: 29-May-2009; LatestRevisionNote: IPC-7351 Footprint Added.; PackageReference: 0402-A; Publisher: Altium Limited; PackageDescription: Chip Inductor; Code_JEITA: 0402
L2-L4 L8 = Inductor: 744771004; Code_IEC: 1005; Published: 8-Jun-2000; LatestRevisionDate: 29-May-2009; LatestRevisionNote: IPC-7351 Footprint Added.; PackageReference: 0402-A; Publisher: Altium Limited; PackageDescription: Chip Inductor; Code_JEITA: 0402
LDR1 = Res Adj1: Variable Resistor; Set Position: 0.5; Published: 8-Jun-2000; LatestRevisionDate: 17-Jul-2002; LatestRevisionNote: Re-released for DXP Platform.; PackageReference: AXIAL-0.7; Publisher: Altium Limited; PackageDescription: Axial Device, Thru-Hole; 2 Leads; 0.7 in Pin Spacing
MIC1 = MICPHONE_80: Value: *
Q1-Q6 = 2N3904: NPN General Purpose Amplifier; Published: 8-Jun-2000; LatestRevisionDate: 15-Jan-2003; LatestRevisionNote: PCB Footprint 'BCY-W3/D4.7' replaced; DatasheetVersion: 1997; PackageVersion: Sep-1998; PackageReference: TO-92A; Publisher: Altium Limited; PackageDescription: TO, Flat Index; 3 In-Line, Axial Leads; Body Dia. 4.5mm; Leads 0.51 x 0.48 mm (max); ComponentLink1Description: Manufacturer Link; ComponentLink1URL: http://www.fairchildsemi.com/; ComponentLink2Description: Datasheet; ComponentLink2URL: http://www.fairchildsemi.com/ds/2N%2F2N3904.pdf
R1-R19 R21-R57 = Res Semi: CRCW04024R02FKED; Published: 8-Jun-2000; LatestRevisionDate: 17-Jul-2002; LatestRevisionNote: Re-released for DXP Platform.; PackageReference: AXIAL-0.5; Publisher: Altium Limited; PackageDescription: Axial Device, Thru-Hole; 2 Leads; 0.5 in Pin Spacing
R20 = Res Semi: AC0402FR-0710KL; Published: 8-Jun-2000; LatestRevisionDate: 17-Jul-2002; LatestRevisionNote: Re-released for DXP Platform.; PackageReference: AXIAL-0.5; Publisher: Altium Limited; PackageDescription: Axial Device, Thru-Hole; 2 Leads; 0.5 in Pin Spacing
SW1 = SW-PB: Switch; Published: 24-Mar-1999; LatestRevisionDate: 17-Jul-2002; LatestRevisionNote: Re-released for DXP Platform.; PackageReference: SPST-2; Publisher: Altium Limited; PackageDescription: Switch; 2 Leads
U1 = TPS62291DRVR: 2.25MHz 1A Step-Down Converter in 2x2mm SON Package 6-WSON -40 to 85; MF: Texas Instruments; Price: None; MP: TPS62291DRVR; Value: *; Package: WSON-6 Texas Instruments; SnapEDA_Link: https://www.snapeda.com/parts/TPS62291DRVR/Texas%20Instruments/view-part/584732/?ref=snap; Availability: Unavailable; Texas_Instruments-Purchase-URL: https://snapeda.com/shop?store=Texas+Instruments&id=584732
U2 = BQ24230_200: Value: *
U4 = MAX9860ETG+: Audio Interface 16 b Serial 24-TQFN _4x4_; MF: Maxim Integrated; Digi-Key_Part_Number: MAX9860ETG+-ND; Package: TQFN-24 Maxim; SnapEDA_Link: https://www.snapeda.com/parts/MAX9860ETG%2B/Maxim%20Integrated/view-part/104791/?ref=snap; MP: MAX9860ETG+; Value: *; Digi-Key_Purchase_URL: https://www.digikey.com/product-detail/en/maxim-integrated/MAX9860ETG-/MAX9860ETG--ND/2044815?utm_source=snapeda&utm_medium=aggregator&utm_campaign=symbol
U5 U11 U12 = AP2125K-2.8TRG1: IC REG LINEAR 2.8V 300MA SOT23-5
U6 = STM32F407VGT6: ARMÂ® CortexÂ®-M4 STM32F4 Microcontroller IC 32-Bit 168MHz 1MB _1M x 8_ FLASH 100-LQFP _14x14_; MF: STMicroelectronics; Value: *; SnapEDA_Link: https://www.snapeda.com/parts/STM32F407VGT6/STMicroelectronics/view-part/106801/?ref=snap; MP: STM32F407VGT6; Availability: Unavailable; Price: None; Package: LQFP-100 STMicroelectronics
U7 U9 = TXB0106PWR: 6-Bit Bidirectional Voltage-Level Translator with Auto Direction Sensing and +/-15-kV ESD Protect 16-TSSOP -40 to 85; MF: Texas Instruments; Texas_Instruments-Purchase-URL: https://snapeda.com/shop?store=Texas+Instruments&id=134340; SnapEDA_Link: https://www.snapeda.com/parts/TXB0106PWR/Texas%20Instruments/view-part/134340/?ref=snap; Value: *; MP: TXB0106PWR; Package: TSSOP-16 Texas Instruments; DigiKey-Purchase-URL: https://snapeda.com/shop?store=DigiKey&id=134340; Availability: Warning; Price: None; Mouser-Purchase-URL: https://snapeda.com/shop?store=Mouser&id=134340
U10 = SMF05CT1G: 12.5V Clamp 8A _8/20Âµs_ Ipp Tvs Diode Surface Mount SC-88/SC70-6/SOT-363; MF: ON Semiconductor; Digi-Key_Part_Number: SMF05CT1GOSCT-ND; Package: SOT-363 ON Semiconductor; MP: SMF05CT1G; SnapEDA_Link: https://www.snapeda.com/parts/SMF05CT1G/ON%20Semiconductor/view-part/266365/?ref=snap; Digi-Key_Purchase_URL: https://www.digikey.com/product-detail/en/on-semiconductor/SMF05CT1G/SMF05CT1GOSCT-ND/1967287?utm_source=snapeda&utm_medium=aggregator&utm_campaign=symbol; Value: *
U13 = CAM-M8C_79: Value: *
U14 = MCU-ISD9160
U15 = ZPT-4RS: RF RECEIVER 433MHZ MODULE
U16 = FLASH-W25X80: 1M-BIT,2M-BIT,4M-BIT AND 8M-BIT SERIAL FLASH MEMORY WITH 4KB SECTORS AND DUAL OUTPUT SPI
Y1 = XTAL: Crystal Oscillator; Published: 8-Jun-2000; LatestRevisionDate: 17-Jul-2002; LatestRevisionNote: Re-released for DXP Platform.; PackageReference: R38; Publisher: Altium Limited; PackageDescription: Crystal, Thru-Hole; 2 Leads; Body 3.1 x 8.2 mm (Dia.xH)
Y2 = XTAL: TFSM262P32K7680; Published: 8-Jun-2000; LatestRevisionDate: 17-Jul-2002; LatestRevisionNote: Re-released for DXP Platform.; PackageReference: R38; Publisher: Altium Limited; PackageDescription: Crystal, Thru-Hole; 2 Leads; Body 3.1 x 8.2 mm (Dia.xH)
ANT1 = Ant W3796_6: Value: *
SP1 = SPEAKER 10mm_193: Value: *
U8 = TOBYL20002S_202: Value: *